# Altium schematic sheet Power.SchDoc
size A4
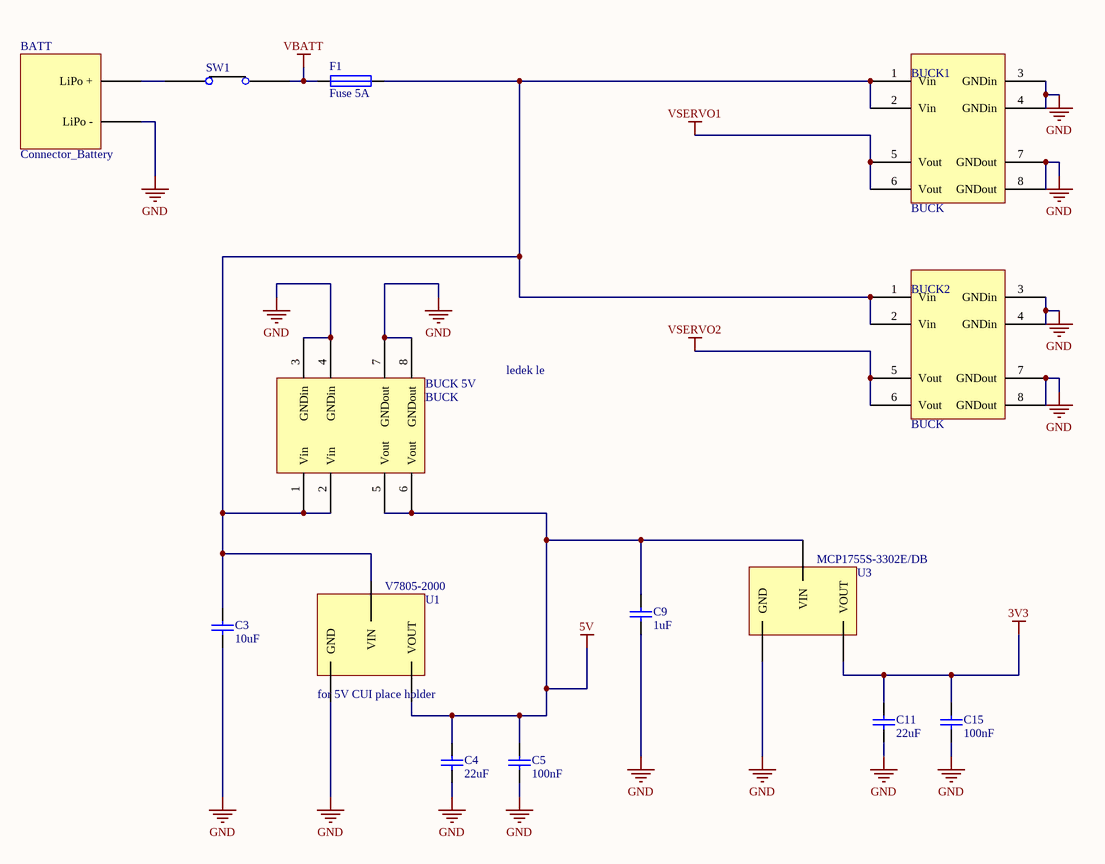
[diagram p0: Power.SchDoc]

## Parts
BATT  Connector_Battery  [CONN_BATT_LiPo_]
BUCK1  BUCK  [BUCK]
BUCK2  BUCK  [BUCK]
BUCK_5V  BUCK  [BUCK]
C3  10uF  [FP_1210_CAP]
C4  22uF  [FP_1210_CAP]
C5  100nF  [FP_1206_CAP_125]
C9  1uF  [FP_1206_CAP_125]
C11  22uF  [FP_1210_CAP]
C15  100nF  [FP_1206_CAP_125]
F1  Fuse 5A  [PTF/16_Fuse_holder]
SW1  Main  [FP_SWITCH_4.8x0.8]  (value not drawn)
U1  V7805-2000  [V7805-2000_Buck]
U3  MCP1755S-3302E/DB  [MCP1755S-3302E/DB_LDO]

## Nets
3V3: C11.2 C15.2 U3.3(VOUT)
5V: BUCK_5V.5(Vout) BUCK_5V.6(Vout) C4.2 C5.2 C9.2 U1.3(VOUT) U3.1(VIN)
GND: BATT.2(LiPo_-) BUCK1.3(GNDin) BUCK1.4(GNDin) BUCK1.7(GNDout) BUCK1.8(GNDout) BUCK2.3(GNDin) BUCK2.4(GNDin) BUCK2.7(GNDout) BUCK2.8(GNDout) BUCK_5V.3(GNDin) BUCK_5V.4(GNDin) BUCK_5V.7(GNDout) BUCK_5V.8(GNDout) C3.1 C4.1 C5.1 C9.1 C11.1 C15.1 U1.2(GND) U3.2(GND)
VBATT: F1.1 SW1.2
VSERVO1: BUCK1.5(Vout) BUCK1.6(Vout)
VSERVO2: BUCK2.5(Vout) BUCK2.6(Vout)
NetBATT_1: BATT.1(LiPo_+) SW1.1
NetBUCK1_1: BUCK1.1(Vin) BUCK1.2(Vin) BUCK2.1(Vin) BUCK2.2(Vin) BUCK_5V.1(Vin) BUCK_5V.2(Vin) C3.2 F1.2 U1.1(VIN)

## Notes on the sheet
- ledek le
- (near U1) for 5V CUI place holder

## Library data of the parts
C3-C5 C9 C11 C15 = CAP: Capacitor
  C3: Supplier: Farnell; Reference: https://hu.farnell.com/kemet/c1210c106k3ractu/cap-10-f-25v-10-x7r-1210/dp/1358512; Value: 10uF
  C4 C11: Supplier: Farnell; Reference: https://hu.farnell.com/kemet/c1210c226k4ractu/cap-22-f-16v-10-x7r-1210/dp/2456343; Value: 22uF; ComponentLink1Description: Supplier; ComponentLink1URL: https://hu.farnell.com/kemet/c1210c226k4ractu/cap-22-f-16v-10-x7r-1210/dp/2456343
  C5 C15: Value: 100nF; ComponentLink1Description: Supplier; ComponentLink1URL: https://hu.farnell.com/yageo/cc1206krx7r8bb104/cap-0-1-f-25v-10-x7r-1206/dp/644316?st=capacitor%20smd
  C9: Supplier: Farnell; Reference: https://hu.farnell.com/multicomp/mcsh31b105k100ct/cap-1-f-10v-10-x7r-1206/dp/1856632; Value: 1uF; ComponentLink1Description: Supplier; ComponentLink1URL: https://hu.farnell.com/multicomp/mcsh31b105k100ct/cap-1-f-10v-10-x7r-1206/dp/1856632
F1 = Fuse
SW1 = SWITCH
U1 = V7805-2000: Module DC-DC 12VIN 1-OUT 5V 2A 10W 3-Pin SIP Module; Manufacturer: CUI; Number of Outputs: 1; Efficiency: 91%; Min Input Voltage: 7V; Max Input Voltage: 18V; Isolation: Non-Isolated; Supplier 1: Digi-Key; Manufacturer Part Number: V7805-2000; RoHS: Yes; Category: Board Mount Modules; Stock 1: 11968; Pricing 1: 1=9,75000, 5=9,67800, 10=9,60400, 25=9,45600, 44=9,16045, 88=8,27398, 264=8,12625, 440=7,97850 (USD); Mount: Through Hole; Case/Package: SIP; Min Operating Temperature: -40°C; Max Operating Temperature: 85°C; Output Power: 10W; Output Voltage: 5V; Package Quantity: 44; Packaging: Rail/Tube; Voltage - Output 1: 5V; Max Output Current: 2A; Max Power Dissipation: 10W; Features: OTP,SCP; Series: V78-2000; Current - Output 1: 2A; Length: 0.45inch; Width: 0.35inch; Height: 0.69inch; Lead Free: Lead Free; RoHS Compliant: Yes; ComponentLink1URL: http://www.mouser.com/ds/2/670/v78-2000-520517.pdf?src-supplier=Mouser; ComponentLink1Description: http://www.mouser.com/ds/2/670/v78-2000-520517.pdf?src-supplier=Mouser; ComponentLink2URL: https://www.cui.com/product/resource/digikeypdf/v78xx-2000.pdf?src-supplier=Digi-Key; ComponentLink2Description: https://www.cui.com/product/resource/digikeypdf/v78xx-2000.pdf?src-supplier=Digi-Key; ComponentLink3URL: http://www.cui.com/Product/Resource/FuturePDF/V78-2000.pdf?src-supplier=Future+Electronics; ComponentLink3Description: http://www.cui.com/Product/Resource/FuturePDF/V78-2000.pdf?src-supplier=Future+Electronics; Supplier Part Number 1: 102-2175-ND
U3 = MCP1755S-3302E/DB: LDO Regulator Pos 3.3V 0.3A 3-Pin SOT-223; Manufacturer: Microchip; Output Current: 300mA; Dropout Voltage: 300mV; Max Input Voltage: 16V; Min Input Voltage: 3.6V; Number of Outputs: 1; Tolerance: 2%; Quiescent Current: 100uA; Polarity: Positive; Power Supply Rejection Ratio (PSRR): 80dB; Nominal Supply Current: 68uA; Output Type: Fixed; Supplier 1: RSComponents; Manufacturer Part Number: MCP1755S-3302E/DB; RoHS: Yes; Category: Voltage Regulators - Linear; Stock 1: 1; Pricing 1: 10=0,94200 (USD); Mount: Surface Mount; Case/Package: SOT-223-3; Number of Pins: 3; Weight: 0.008826oz; Min Operating Temperature: -40°C; Max Operating Temperature: 125°C; Nominal Output Voltage: 3.3V; Output Voltage: 3.3V; Packaging: Bulk; Package Quantity: 78; Max Output Current: 300mA; Accuracy: 2%; Series: MCP1755; Supply Current: 68uA; Length: 6.7mm; Width: 3.7mm; Height: 1.7mm; REACH SVHC: No SVHC; Lead Free: Lead Free; RoHS Compliant: Yes; ComponentLink1URL: https://datasheet.ciiva.com/48506/mcp1755s-eng-tds-48506837.pdf?src-supplier=Distrelec; ComponentLink1Description: https://datasheet.ciiva.com/48506/mcp1755s-eng-tds-48506837.pdf?src-supplier=Distrelec; ComponentLink2URL: https://datasheet.ciiva.com/22748/1697992-22748101.pdf?src-supplier=Element14; ComponentLink2Description: https://datasheet.ciiva.com/22748/1697992-22748101.pdf?src-supplier=Element14; ComponentLink3URL: https://datasheet.ciiva.com/24137/25160a-238586-24137546.pdf?src-supplier=Mouser; ComponentLink3Description: https://datasheet.ciiva.com/24137/25160a-238586-24137546.pdf?src-supplier=Mouser; Supplier Part Number 1: 7990389